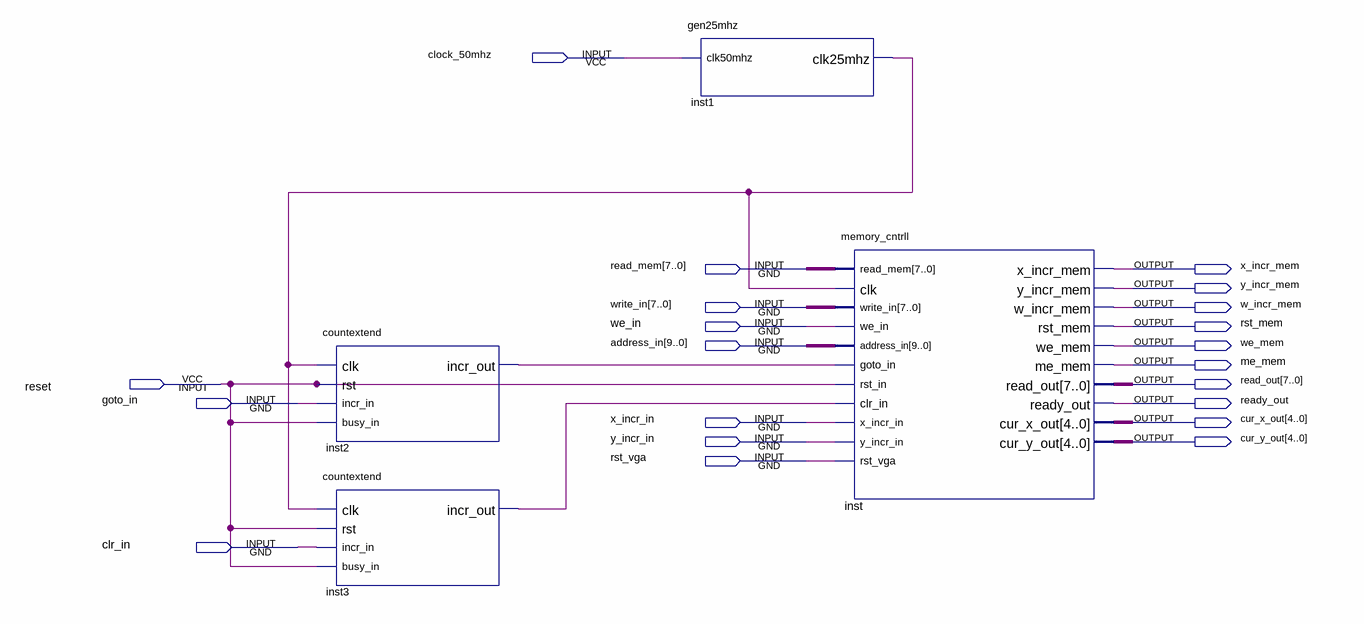
[diagram p0: schematic sheet]
// Quartus schematic top_de1.bdf as structural Verilog: 4 symbols, 21 pins
module top_de1 (
  input  clock_50mhz,
  input  [7:0] read_mem,
  input  [7:0] write_in,
  input  we_in,
  input  [9:0] address_in,
  input  reset,
  input  goto_in,
  input  x_incr_in,
  input  y_incr_in,
  input  rst_vga,
  input  clr_in,
  output x_incr_mem,
  output y_incr_mem,
  output w_incr_mem,
  output rst_mem,
  output we_mem,
  output me_mem,
  output [7:0] read_out,
  output ready_out,
  output [4:0] cur_x_out,
  output [4:0] cur_y_out
);

  wire inst1_clk25mhz, inst2_incr_out, inst3_incr_out;

  countextend inst2 (.clk(inst1_clk25mhz), .rst(reset), .incr_in(goto_in), .busy_in(reset), .incr_out(inst2_incr_out));
  countextend inst3 (.clk(inst1_clk25mhz), .rst(reset), .incr_in(clr_in), .busy_in(reset), .incr_out(inst3_incr_out));
  gen25mhz inst1 (.clk50mhz(clock_50mhz), .clk25mhz(inst1_clk25mhz));
  memory_cntrll inst (
    .read_mem(read_mem), .clk(inst1_clk25mhz), .write_in(write_in), .we_in(we_in), .address_in(address_in),
    .goto_in(inst2_incr_out), .rst_in(reset), .clr_in(inst3_incr_out), .x_incr_in(x_incr_in),
    .y_incr_in(y_incr_in), .rst_vga(rst_vga), .x_incr_mem(x_incr_mem), .y_incr_mem(y_incr_mem),
    .w_incr_mem(w_incr_mem), .rst_mem(rst_mem), .we_mem(we_mem), .me_mem(me_mem), .read_out(read_out),
    .ready_out(ready_out), .cur_x_out(cur_x_out), .cur_y_out(cur_y_out));
endmodule
